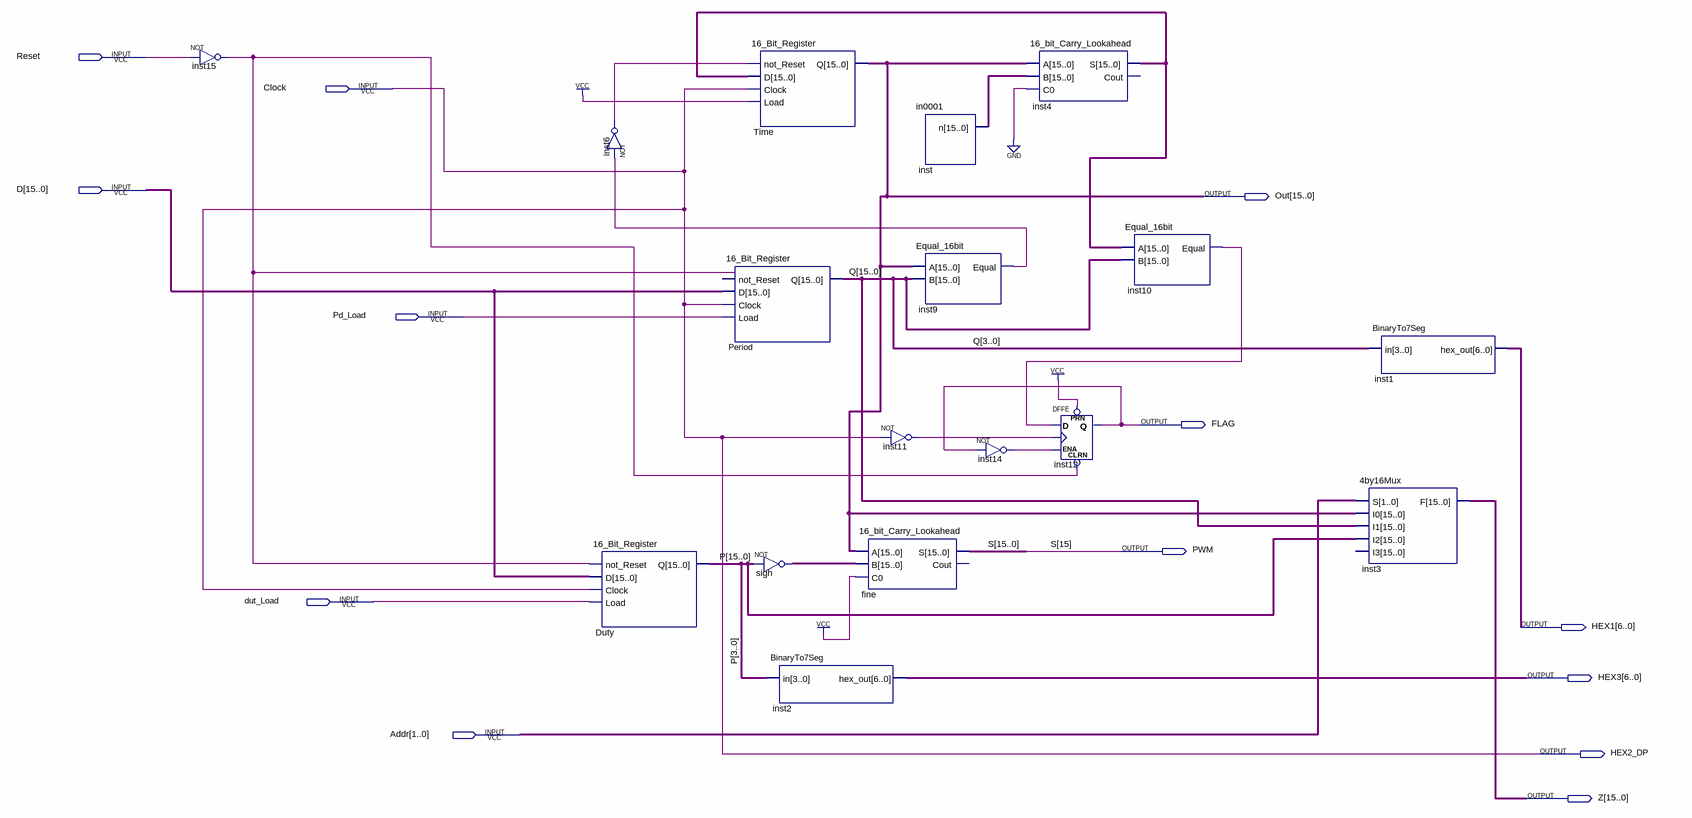
[diagram p0: schematic sheet]
// Quartus schematic Timer.bdf as structural Verilog: 17 symbols, 13 pins
module Timer (
  input  Reset,
  input  Clock,
  input  [15:0] D,
  input  Pd_Load,
  input  dut_Load,
  input  [1:0] Addr,
  output [15:0] Out,
  output FLAG,
  output PWM,
  output [6:0] HEX1,
  output [6:0] HEX3,
  output HEX2_DP,
  output [15:0] Z
);

  wire inst6_out, inst9_equal, inst10_equal, inst11_out, inst14_out, inst15_out;
  wire [14:0] S;
  wire [15:0] inst4_s, inst_n, P, Q, sigh_out;

  not inst15 (inst15_out, Reset);
  \16_Bit_Register  Duty (.not_Reset(inst15_out), .D(D), .Clock(Clock), .Load(dut_Load), .Q(P));
  not inst6 (inst6_out, inst9_equal);
  \16_Bit_Register  Time (.not_Reset(inst6_out), .D(inst4_s), .Clock(Clock), .Load(1'b1), .Q(Out));
  \16_Bit_Register  Period (.not_Reset(inst15_out), .D(D), .Clock(Clock), .Load(Pd_Load), .Q(Q));
  assign sigh_out = ~P;  // NOT sigh, 16 bits wide
  BinaryTo7Seg inst2 (.in(P[3:0]), .hex_out(HEX3));
  not inst11 (inst11_out, Clock);
  \16_bit_Carry_Lookahead  fine (.A(Out), .B(sigh_out), .C0(1'b1), .S({PWM, S}));  // open: Cout
  in0001 inst (.n(inst_n));
  Equal_16bit inst9 (.A(Out), .B(Q), .Equal(inst9_equal));
  not inst14 (inst14_out, FLAG);
  \16_bit_Carry_Lookahead  inst4 (.A(Out), .B(inst_n), .C0(1'b0), .S(inst4_s));  // open: Cout
  DFFE inst12 (.PRN(1'b1), .CLRN(inst15_out), .D(inst10_equal), .CLK(inst11_out), .ENA(inst14_out), .Q(FLAG));
  Equal_16bit inst10 (.A(inst4_s), .B(Q), .Equal(inst10_equal));
  \4by16Mux  inst3 (.S(Addr), .I0(Out), .I1(Q), .I2(P), .F(Z));  // open: I3
  BinaryTo7Seg inst1 (.in(Q[3:0]), .hex_out(HEX1));

  assign HEX2_DP = Clock;

  // Other names for the same wires on the sheet: S[15] = PWM
endmodule
